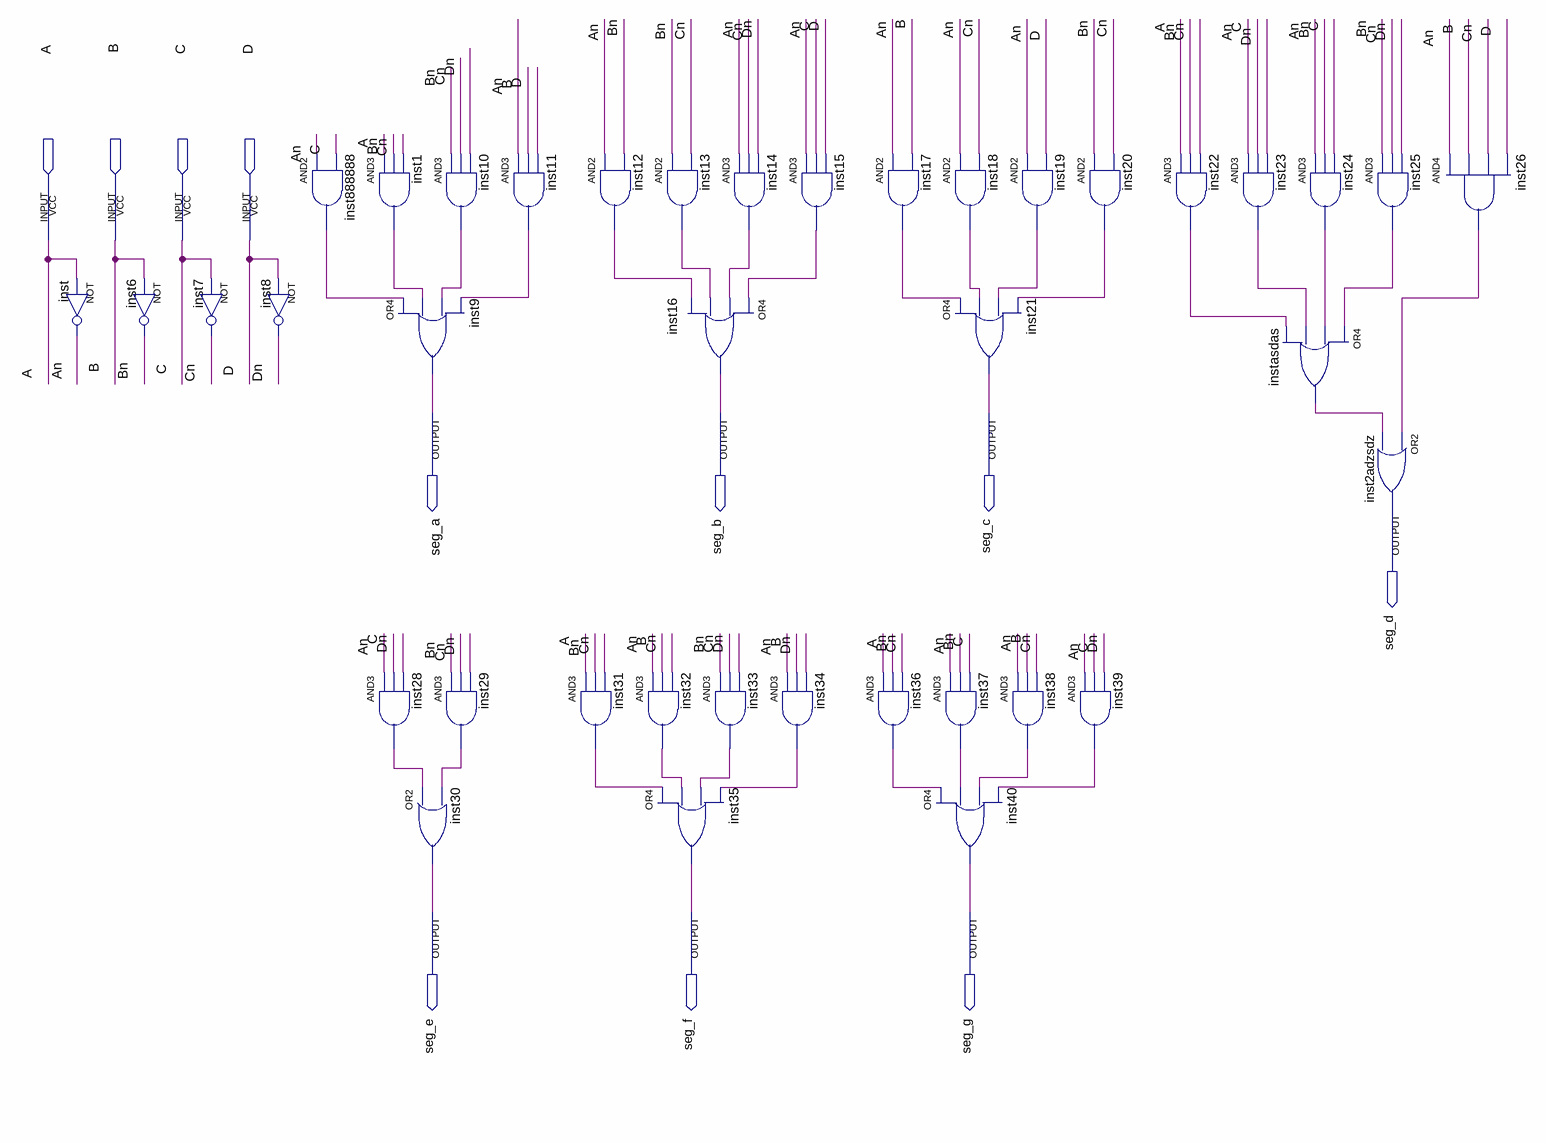
[diagram p0: schematic sheet]
// Quartus schematic BDC_catode.bdf as structural Verilog: 39 symbols, 11 pins
module BDC_catode (
  input  A,
  input  B,
  input  C,
  input  D,
  output seg_a,
  output seg_b,
  output seg_c,
  output seg_d,
  output seg_e,
  output seg_f,
  output seg_g
);

  wire An, Bn, Cn, Dn, inst1_out, inst10_out, inst11_out, inst12_out, inst13_out, inst14_out, inst15_out,
       inst17_out, inst18_out, inst19_out, inst20_out, inst22_out, inst23_out, inst24_out, inst25_out,
       inst26_out, inst28_out, inst29_out, inst31_out, inst32_out, inst33_out, inst34_out, inst36_out,
       inst37_out, inst38_out, inst39_out, inst888888_out, instasdas_out;

  not inst (An, A);
  not inst6 (Bn, B);
  not inst7 (Cn, C);
  not inst8 (Dn, D);
  and inst888888 (inst888888_out, An, C);
  and inst1 (inst1_out, A, Bn, Cn);
  and inst10 (inst10_out, Bn, Cn, Dn);
  or inst9 (seg_a, inst888888_out, inst1_out, inst10_out, inst11_out);
  and inst28 (inst28_out, An, C, Dn);
  and inst29 (inst29_out, Bn, Cn, Dn);
  or inst30 (seg_e, inst28_out, inst29_out);
  and inst11 (inst11_out, An, B, D);
  and inst12 (inst12_out, An, Bn);
  and inst31 (inst31_out, A, Bn, Cn);
  and inst13 (inst13_out, Bn, Cn);
  and inst32 (inst32_out, An, B, Cn);
  or inst35 (seg_f, inst31_out, inst32_out, inst33_out, inst34_out);
  and inst14 (inst14_out, An, Cn, Dn);
  or inst16 (seg_b, inst15_out, inst14_out, inst13_out, inst12_out);
  and inst33 (inst33_out, Bn, Cn, Dn);
  and inst15 (inst15_out, An, C, D);
  and inst34 (inst34_out, An, B, Dn);
  and inst17 (inst17_out, An, B);
  and inst36 (inst36_out, A, Bn, Cn);
  and inst18 (inst18_out, An, Cn);
  or inst21 (seg_c, inst17_out, inst18_out, inst19_out, inst20_out);
  and inst37 (inst37_out, An, Bn, C);
  or inst40 (seg_g, inst36_out, inst37_out, inst38_out, inst39_out);
  and inst19 (inst19_out, An, D);
  and inst38 (inst38_out, An, B, Cn);
  and inst20 (inst20_out, Bn, Cn);
  and inst39 (inst39_out, An, C, Dn);
  and inst22 (inst22_out, A, Bn, Cn);
  and inst23 (inst23_out, An, C, Dn);
  or instasdas (instasdas_out, inst25_out, inst24_out, inst23_out, inst22_out);
  and inst24 (inst24_out, An, Bn, C);
  and inst25 (inst25_out, Bn, Cn, Dn);
  and inst26 (inst26_out, An, B, Cn, D);
  or inst2adzsdz (seg_d, inst26_out, instasdas_out);
endmodule
